# EAGLE design nRF51_key (EAGLE 9.5.2)
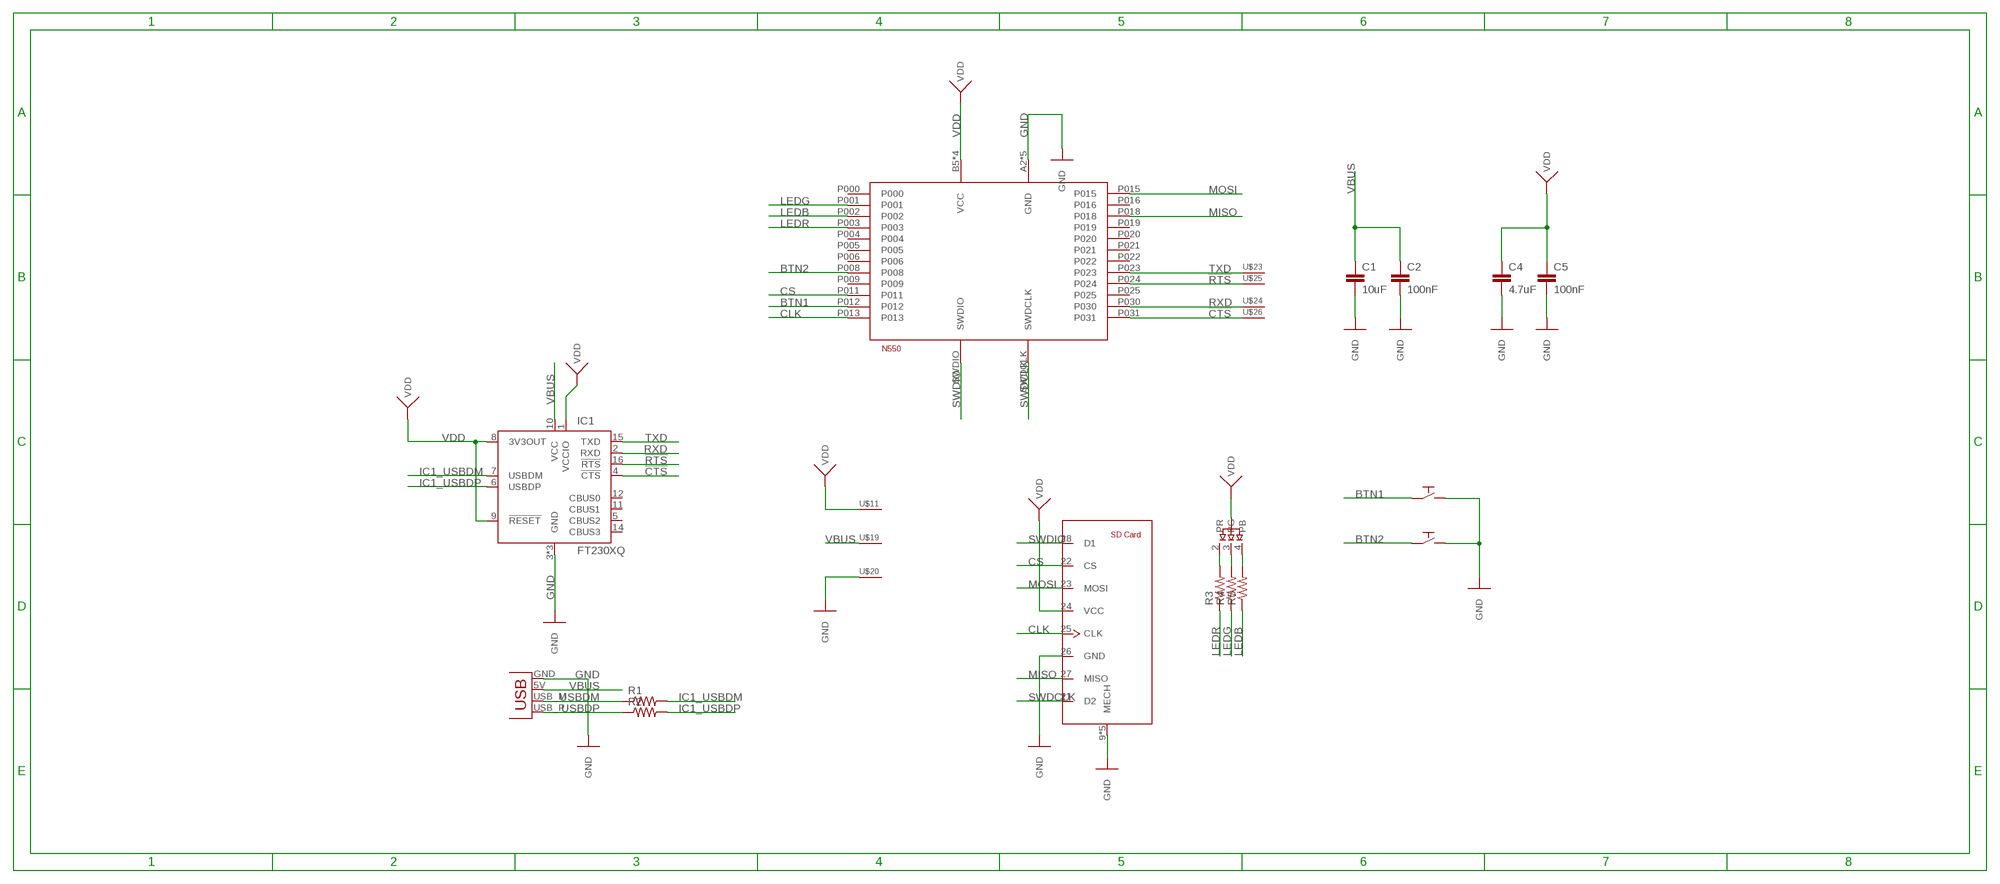
[diagram p0: schematic, sheet 1]

## Parts
C1  10uF  CAPACITOR0603  [C0603]
C2  100nF  CAPACITOR0603  [C0603]
C4  4.7uF  CAPACITOR0603  [C0603]
C5  100nF  CAPACITOR0603  [C0603]
D1  LRTBR48G  [LRTBR48GP9Q71R7S526NP68]
IC1  FT230XQ  [QFN16]
J1  47571-0001  [47571-0001]
R1  RESISTOR0603  [R0603]
R2  RESISTOR0603  [R0603]
R3  RESISTOR0603  [R0603]
R4  RESISTOR0603  [R0603]
R5  RESISTOR0603  [R0603]
SPST1  PTS526SK08  [PTS526SKG15SMTR2LFS]
SPST2  PTS526SK08  [PTS526SKG15SMTR2LFS]
U$1  N550  [N550]
U$11  PAD  [PAD_0.8]
U$19  PAD  [PAD_0.8]
U$20  PAD  [PAD_0.8]
U$23  PAD  [PAD_0.8]
U$24  PAD  [PAD_0.8]
U$25  PAD  [PAD_0.8]
U$26  PAD  [PAD_0.8]
X1  USBPCB  [USB-A-PCB]

## Nets
!CTS: IC1.4(!CTS) U$1.P031 U$26.PAD
!RTS: IC1.16(!RTS) U$1.P024 U$25.PAD
BTN1: SPST1.1 SPST1.2 U$1.P012
BTN2: SPST2.1 SPST2.2 U$1.P008
CLK: J1.25(CLK) U$1.P013
CS: J1.22(CS) U$1.P011
GND: C1.2 C2.2 C4.2 C5.2 IC1.3(GND) IC1.13(GND) IC1.EXP(GND) J1.9(MECH) J1.10(MECH) J1.11(MECH) J1.12(MECH) J1.13(MECH) J1.26(GND) SPST1.3 SPST1.4 SPST2.3 SPST2.4 U$1.A2(GND) U$1.A3(GND) U$1.A4(GND) U$1.A5(GND) U$1.A6(GND) U$20.PAD X1.GND
IC1_USBDM: IC1.7(USBDM) R1.2
IC1_USBDP: IC1.6(USBDP) R2.2
LEDB: R5.1 U$1.P002
LEDG: R4.1 U$1.P001
LEDR: R3.1 U$1.P003
MISO: J1.27(MISO) U$1.P018
MOSI: J1.23(MOSI) U$1.P015
N$1: D1.2(PR) R3.2
N$2: D1.3(PG) R4.2
N$3: D1.4(PB) R5.2
RXD: IC1.2(RXD) U$1.P030 U$24.PAD
SWDCLK: J1.21(D2) U$1.SWDCLK
SWDIO: J1.28(D1) U$1.SWDIO
TXD: IC1.15(TXD) U$1.P023 U$23.PAD
USBDM: R1.1 X1.USB_M(D-)
USBDP: R2.1 X1.USB_P(D+)
VBUS: C1.1 C2.1 IC1.10(VCC) U$19.PAD X1.5V(VBUS)
VDD: C4.1 C5.1 D1.1 IC1.1(VCCIO) IC1.8(3V3OUT) IC1.9(!RESET) J1.24(VCC) U$1.B5(VCC) U$1.B6(VCC) U$1.C5(VCC) U$1.C6(VCC) U$11.PAD
Unconnected: IC1.5(CBUS2) IC1.11(CBUS1) IC1.12(CBUS0) IC1.14(CBUS3) U$1.P000 U$1.P004 U$1.P005 U$1.P006 U$1.P009 U$1.P016 U$1.P019 U$1.P020 U$1.P021 U$1.P022 U$1.P025

## Library data of the parts
C1 C2 C4 C5 = Passives:CAPACITOR: Capacitor
D1 = KPA_LED:LRTBR48G: RGB LED in a single package
IC1 = FTDI:FT230X: USB to Basic UART IC Source: http://www.ftdichip.com/Support/Documents/DataSheets/ICs/DS_FT230X.pdf; MF: FTDI; MPN: FT230XQ; OC_FARNELL: 2081324; OC_NEWARK: 83T7086
J1 = SD_Card:47571-0001: Memory Card Connectors ASSY FOR TFR HEADER HEADER W/DETECT PIN Source: Datasheet <http://www.mouser.com/ds/2/276/0475710001_MEMORY_CARD_SOCKET-170076.pdf>
R1-R5 = Passives:RESISTOR: Resistor
SPST1 SPST2 = SPST:PTS526SK08: Interrupteurs de contact 50mA 12VDC, 5.2x5.2mm, 0.8mm H, 260gf, G leads, No ground pin, no actuator Button SPST; MTN: 611-PTS526SK08SMTR2L
U$1 = N5:N550: Based on Nordic Semiconductor’s nRF51422 SoC, the N5 ANT SoC module series offers support for both ANT® and Bluetooth® low energy and enables both protocols to run concurrently, depending on the loaded protocol stack. The N5 ANT SoC module series starts with N548M8CB in a 14.0mm x 9.8mm x 2.0mm LGA (Land Array Grid) package. A compact design meeting the market requirements for small, light and wearable, the N548M8CB is a turnkey system hardware solution including antenna, onboard 32k and 16M crystal clocks, DC-DC converter and 24 GPIOs with 6 analogue inputs. The N548 modules are pre-programmed with the following software components:  S210 SoftDevice (ANT 8-channel protocol stack)  ANT network processor application  ANT-WP (Wireless Programming) bootloader (depends on module version) SoftDevices are protocol stack solutions from Nordic Semiconductor for the nRF51 SoCs. There are multiple SoftDevice choices available from the Nordic Semiconductor’s web site. The ANT network processor application offers the standard ANT serial interface front-end that is connectable to an external application controller. The ANT-WP bootloader allows over-the-air updates of any software components on the N548 module. The N548 module pre-programmed image can be easily replaced via the onboard SWD interface pins using offthe- shelf ARM programming tools or over the air using the pre-loaded ANT-WP bootloader. Pin compatible options to the 20mm x 20mm AP2 or C7 modules from Dynastream are also available. In these options, N548M8CB modules are soldered on carrier boards that are pin compatible to the previous modules. Current AP2 or C7 module customers can easily use these models to evaluate the hardware and upgrade their products. The N5 module series if loaded with ANT and/or BLUETOOTH Low energy stack has been certified to comply with radio regulation or standards covering major markets include North America, Europe, Australia, New Zealand and Japan. The N5 ANT SoC modules series has also been qualified by the BLUETOOTH SIG.
U$11 U$19 U$20 U$23-U$26 = ParanoidStudio:PAD
X1 = USB:USB: USB Connectors USB-B-PTH is fully proven SKU : PRT-00139 USB-miniB is fully proven SKU : PRT-00587 USB-A-PCB is untested. USB-A-H is throughly reviewed, but untested. Spark Fun Electronics SKU : PRT-00437 USB-B-SMT is throughly reviewed, but untested. Needs silkscreen touching up. USB-A-S has not been used/tested USB-MB-H has not been used/tested

## Net classes
0 default: width 0.152 mm, drill 0.3 mm, clearance 0.152 mm

## Board
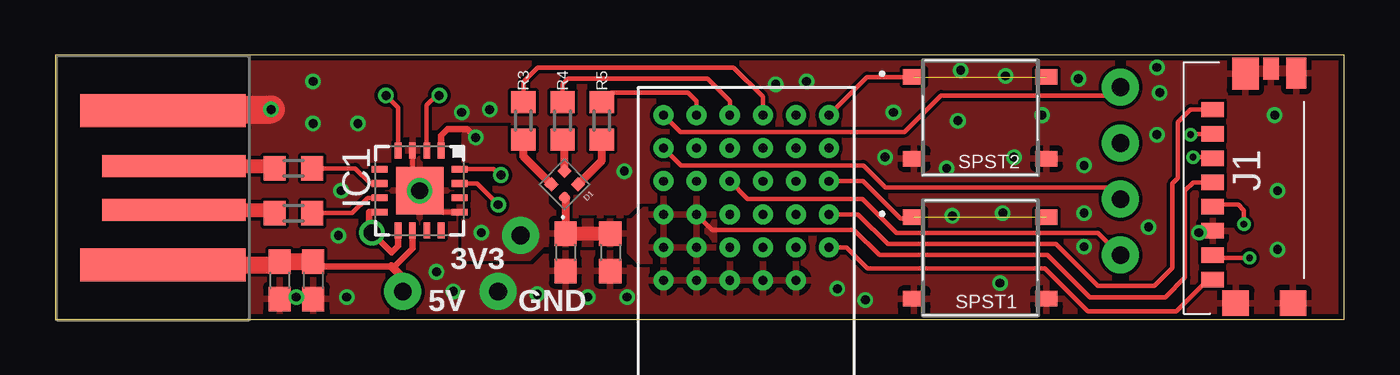
[diagram p1: board, top side]
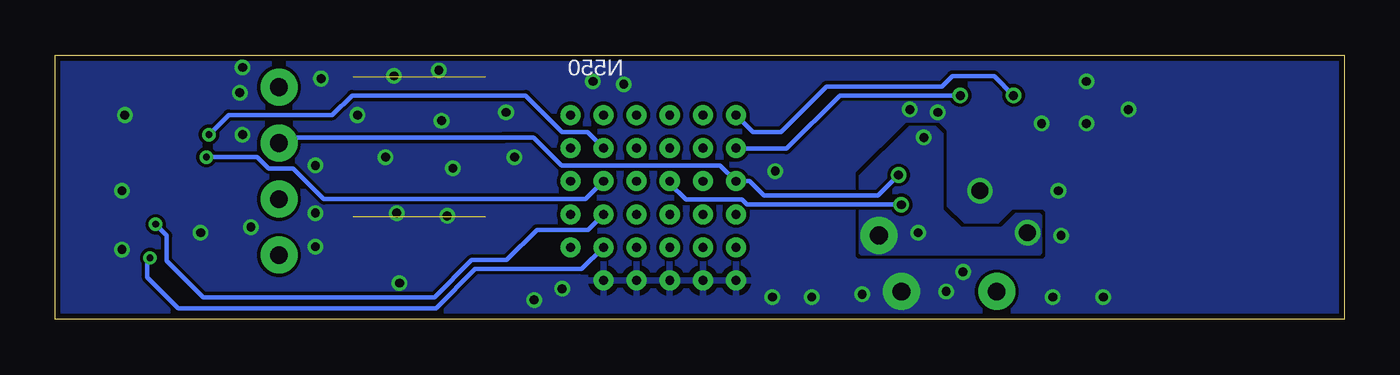
[diagram p2: board, bottom side, seen from below]

Size 58.4 x 11.99 mm. Coordinates in mm from the lower left corner, seen from the top.
Outline: 0,0 58.4,0 58.4,11.99 0,11.99 0,0
Copper layers (1*16): Top 0.035mm / dielectric 1.5mm / Bottom 0.035mm
Design rules "SeeedStudio_2layer_DRU_no_angle_20140221": minimum track width 6mil, minimum drill 12mil, track to track 6mil, track to pad 6mil, pad to pad 6mil, via to via 6mil, smd to smd 0mil, copper to edge 10mil, drill to drill 10mil, minimum pad ring 10mil, minimum via ring 6mil, stop-mask expansion 2mil, vias tented up to drill 100mil, thermal gap 10mil

### Footprints (pad centres in the part's own frame; a part is rotated, then mirrored left to right if it is on the bottom)
C0603 = smd 1.1 x 1: 1 -0.85,0; 2 0.85,0
LRTBR48GP9Q71R7S526NP68 = smd 0.45 x 0.45: 1 0.425,0.425; 2 0.425,-0.425; 3 -0.425,-0.425; 4 -0.425,0.425
QFN16 = smd 0.725 x 0.3: 1 -1.812,0.975; 2 -1.812,0.325; 3 -1.812,-0.325; 4 -1.812,-0.975; 9 1.812,-0.975; 10 1.812,-0.325; 11 1.812,0.325; 12 1.812,0.975 | smd 0.3 x 0.725: 5 -0.975,-1.812; 6 -0.325,-1.812; 7 0.325,-1.812; 8 0.975,-1.812; 13 0.975,1.812; 14 0.325,1.812; 15 -0.325,1.812; 16 -0.975,1.812 | smd 2.15 x 2.15: EXP 0,0
47571-0001 = smd 1.15 x 1.2: 9 -5.225,0.365; 10 -5.225,-2.225 | smd 1.45 x 1.2: 11 5.175,-0.075 | smd 1 x 0.7: 12 5.4,-1.225 | smd 1.4 x 0.9: 13 5.2,-2.375 | smd 0.7 x 1: 21 3.55,1.415; 22 2.45,1.415; 23 1.35,1.415; 24 0.25,1.415; 25 -0.85,1.415; 26 -1.95,1.415; 27 -3.05,1.415; 28 -4.15,1.415
R0603 = smd 1 x 1.1: 1 -0.85,0; 2 0.85,0
PTS526SKG15SMTR2LFS = smd 1 x 0.7: 1 -3,1.85; 2 3,1.85; 3 -3,-1.85; 4 3,-1.85
N550 = drill 0.4 pad 0.72: A2 1.62,7.5; A3 3.12,7.5; A4 4.62,7.5; A5 6.12,7.5; A6 7.62,7.5; B5 6.12,6; B6 7.62,6; C5 6.12,4.5; C6 7.62,4.5; P000 6.12,1.5; P001 4.62,0; P002 6.12,0; P003 3.12,0; P004 4.62,1.5; P005 1.62,0; P006 3.12,1.5; P008 0.12,0; P009 0.12,1.5; P011 1.62,1.5; P012 0.12,3; P013 1.62,4.5; P015 1.62,3; P016 3.12,4.5; P018 1.62,6; P019 4.62,6; P020 3.12,6; P021 6.12,3; P022 4.62,4.5; P023 4.62,3; P024 7.62,3; P025 3.12,3; P030 7.62,1.5; P031 7.62,0; SWDCLK 0.12,4.5; SWDIO 0.12,6
PAD_0.8 = drill 0.8 pad 1.676: PAD 0,0
USB-A-PCB = smd 7.5 x 1.5: 5V -0.2,-3.5; GND -0.2,3.5 | smd 6.5 x 1: USB_M 0.3,-1; USB_P 0.3,1

### Placement (x,y rotation side)
C1  10.16,1.78 270 top
C2  11.68,1.78 270 top
C4  23.11,3.05 270 top
C5  25.15,3.05 270 top
D1  23.08,6.13 225 top
IC1  16.51,5.84 270 top
J1  53.85,5.97 90 top
R1  10.79,4.83 0 top
R2  10.79,6.86 0 top
R3  21.21,9.02 270 top
R4  22.99,9.02 270 top
R5  24.77,9.02 270 top
SPST1  41.91,2.79 0 top
SPST2  41.91,9.14 0 top
U$1  35.18,9.27 180 top
U$11  21.08,3.81 0 top
U$19  15.75,1.27 0 top
U$20  20.07,1.27 0 top
U$23  48.26,2.92 0 top
U$24  48.26,5.46 0 top
U$25  48.26,8 0 top
U$26  48.26,10.54 0 top
X1  5.08,5.97 0 top

### Tracks (layer width: path | path; a pad name or v marks a point on that pad's centre or on a via)
!CTS  (via drill 0.4)
  Top 0.203: IC1.4 15.54,9.61 v14.99,10.16 | U$1.P031 28.32,8.51 38.48,8.51 40.13,10.16 47.88,10.16 U$26.PAD
  Bottom 0.203: v14.99,10.16 15.86,11.04 17.76,11.04 18.23,10.57 23.47,10.57 25.53,8.51 26.8,8.51 U$1.P031
!RTS  (via drill 0.4)
  Top 0.203: IC1.16 19.85,6.82 20.19,6.48 v20.19,6.55
  Bottom 0.203: v20.19,6.55 21.13,5.61 26.29,5.61 26.94,6.27 U$1.P024 28.27,6.99 35.46,6.99 36.72,8.24 38.09,8.24 38.1,8.26 48.01,8.26 U$25.PAD
BTN1  (1 unrouted)
  Top 0.203: SPST1.1 38.84,4.57 38.29,4.57 36.59,6.27 U$1.P012
BTN2  (1 unrouted)
  Top 0.203: U$1.P008 36.78,10.99 SPST2.1
CLK  (via drill 0.3)
  Top 0.203: v53.85,4.32 53.85,4.95 53.59,5.21 52.52,5.21 J1.25
  Bottom 0.203: U$1.P013 34.27,4.06 36.58,4.06 37.95,2.69 39.54,2.69 41.22,1.02 51.69,1.02 53.34,2.67 53.34,3.81 v53.85,4.32
CS  (via drill 0.3)
  Top 0.203: J1.22 51.47,8.42 v51.44,8.38
  Bottom 0.203: v51.44,8.38 50.55,9.27 45.85,9.27 44.96,10.16 37.08,10.16 35.43,8.51 34.29,8.51 U$1.P011
GND  (via drill 0.4, 0.76)
  Top 0.203: IC1.3 16.18,6.17 IC1.EXP 17.48,4.87 IC1.13 | J1.26 52.35,3.94 v51.82,3.94
  Top 0.762: X1.GND 4.94,9.53
  Top 1.27: 4.94,9.53 v9.78,9.53
  other vias: 16.51,5.84 11.68,8.89 11.68,10.79 13.72,8.89 18.03,1.27 21.84,1.14 25.78,6.73 37.59,7.37 40.89,9.02 44.7,9.27 43.43,7.37 55.37,3.18 55.37,5.84 55.24,9.27 49.91,11.43 13.21,1.02 36.7,0.89 25.91,1.02 24.13,1.02 35.43,1.4 34.04,10.79 10.92,1.02 12.95,5.84 12.83,3.81 46.61,6.99 46.61,4.83 49.53,4.19 49.91,8.38 50.04,10.29 19.68,9.53 18.41,9.4 17.27,2.16 32.64,10.67 42.8,1.65 46.61,3.3 40.39,6.86 46.35,10.92 37.97,9.4 41.02,11.3 40.64,4.7 42.93,4.83 43.05,11.05
  pour Bottom (rank 2): -3.94,9.53 -3.94,12.45 -1.4,14.99 55.5,14.99 55.75,14.73 58.8,11.68 58.8,11.18 58.8,-4.06 57.4,-5.46 -2.41,-5.46 -3.94,-3.94
  pour Top (rank 2): 9.02,-5.08 9.02,13.08 9.78,13.84 57.91,13.84 59.69,12.06 59.69,-6.98 58.04,-8.64 12.45,-8.64 9.02,-5.21
IC1_USBDM
  Top 0.203: R1.2 13.46,4.83 14.15,5.52 IC1.7
IC1_USBDP
  Top 0.203: R2.2 13.59,6.86 14.28,6.17 IC1.6
LEDB
  Top 0.203: R5.1 25.18,10.29 28.68,10.29 29.06,9.91 U$1.P002
LEDG
  Top 0.203: R4.1 22.99,10.67 23.24,10.92 29.54,10.92 30.56,9.91 U$1.P001
LEDR
  Top 0.203: R3.1 21.21,10.79 21.84,11.43 30.73,11.43 32.06,10.11 U$1.P003
MISO  (via drill 0.3)
  Top 0.203: v54.1,2.79 52.56,2.79 J1.27
  Bottom 0.203: U$1.P018 34.54,2.29 39.37,2.29 41.15,0.51 52.83,0.51 54.23,1.91 54.23,2.67 v54.1,2.79
MOSI  (via drill 0.3)
  Top 0.203: v51.55,7.37 52.39,7.37 J1.23
  Bottom 0.203: U$1.P015 34.37,5.46 46.23,5.46 47.62,6.86 48.73,6.86 49.24,7.37 v51.55,7.37
N$1
  Top 0.356: D1.2 21.21,7.4 R3.2
N$2
  Top 0.356: D1.3 23.08,8.08 R4.2
N$3
  Top 0.356: D1.4 24.77,7.22 R5.2
RXD  (via drill 0.4)
  Top 0.203: IC1.2 16.84,9.72 17.27,10.16 v17.4,10.16 | U$1.P030 28.34,6.99 36.61,6.99 37.61,5.98 47.87,5.98 48.26,5.59 U$24.PAD
  Bottom 0.203: v17.4,10.16 22.86,10.16 25.27,7.75 27.54,7.75 U$1.P030
SWDCLK
  Top 0.203: U$1.SWDCLK 36.38,4.77 37.72,3.43 45.34,3.43 47.24,1.52 49.78,1.52 50.61,2.35 50.61,6.16 50.86,6.41 50.86,8.95 51.43,9.52 J1.21
SWDIO
  Top 0.203: U$1.SWDIO 35.84,3.27 36.79,2.33 44.83,2.33 46.78,0.38 50.8,0.38 52.24,1.82 J1.28
TXD  (via drill 0.4)
  Top 0.203: IC1.15 19.11,6.17 v20.07,5.21 | U$1.P023 31.37,5.46 36.58,5.46 38.1,3.94 47.24,3.94 U$23.PAD
  Bottom 0.203: v20.07,5.21 27.05,5.21 27.28,5.44 29.82,5.44 30.56,6.18 U$1.P023
USBDM
  Top 0.203: 9.8,4.97 R1.1
  Top 0.635: X1.USB_M 9.8,4.97
USBDP
  Top 0.203: 9.83,6.97 R2.1
  Top 0.635: X1.USB_P 9.83,6.97
VBUS
  Top 0.305: IC1.10 16.18,3.23 15.37,2.41 15.24,2.41 11.9,2.41 C2.1
  Top 0.356: U$19.PAD 15.75,1.91 15.24,2.41
  Top 0.762: X1.5V 10,2.47 C1.1 C2.1
VDD  (via drill 0.4, 0.76)
  Top 0.203: U$1.C5 29.77,4.06 36.2,4.06 37.34,2.92 44.96,2.92 46.86,1.02 50.29,1.02 51.18,1.91 51.18,5.84 51.56,6.22 J1.24
  Top 0.305: IC1.1 17.48,8.34 17.78,8.64 18.67,8.64 v19.05,8.26 | IC1.8 14.22,4.87 14.22,4.06 v14.35,3.94 15.24,3.05 15.54,3.34 IC1.9
  Top 0.356: D1.1 23.11,5.5 C4.1
  Top 0.635: C4.1 C5.1
  other vias: 19.3,3.94
  pour Bottom: 13.84,3.05 13.84,4.7 14.86,4.7 15.49,4.06 17.4,4.06 18.29,4.95 18.29,8.38 18.54,8.64 19.68,8.64 21.84,6.48 21.84,3.05
  pour Top: 18.54,5.97 18.54,8.38 18.8,8.64 20.57,8.64 20.7,8.51 22.23,6.99 22.23,5.21 22.86,4.57 23.5,4.57 23.62,4.45 26.16,4.45 27.18,5.46 27.3,5.46 29.46,5.46 29.84,5.08 29.84,2.79 29.72,2.67 26.42,2.67 26.04,3.05 26.04,3.3 25.91,3.43 24.64,3.43 22.1,3.43 21.46,2.79 20.7,2.79 18.67,2.79 18.54,2.92

### Text on the board
tNames: 3V3 | 5V | GND